# EAGLE design ARC Lighting v1.0 (EAGLE 6.4)
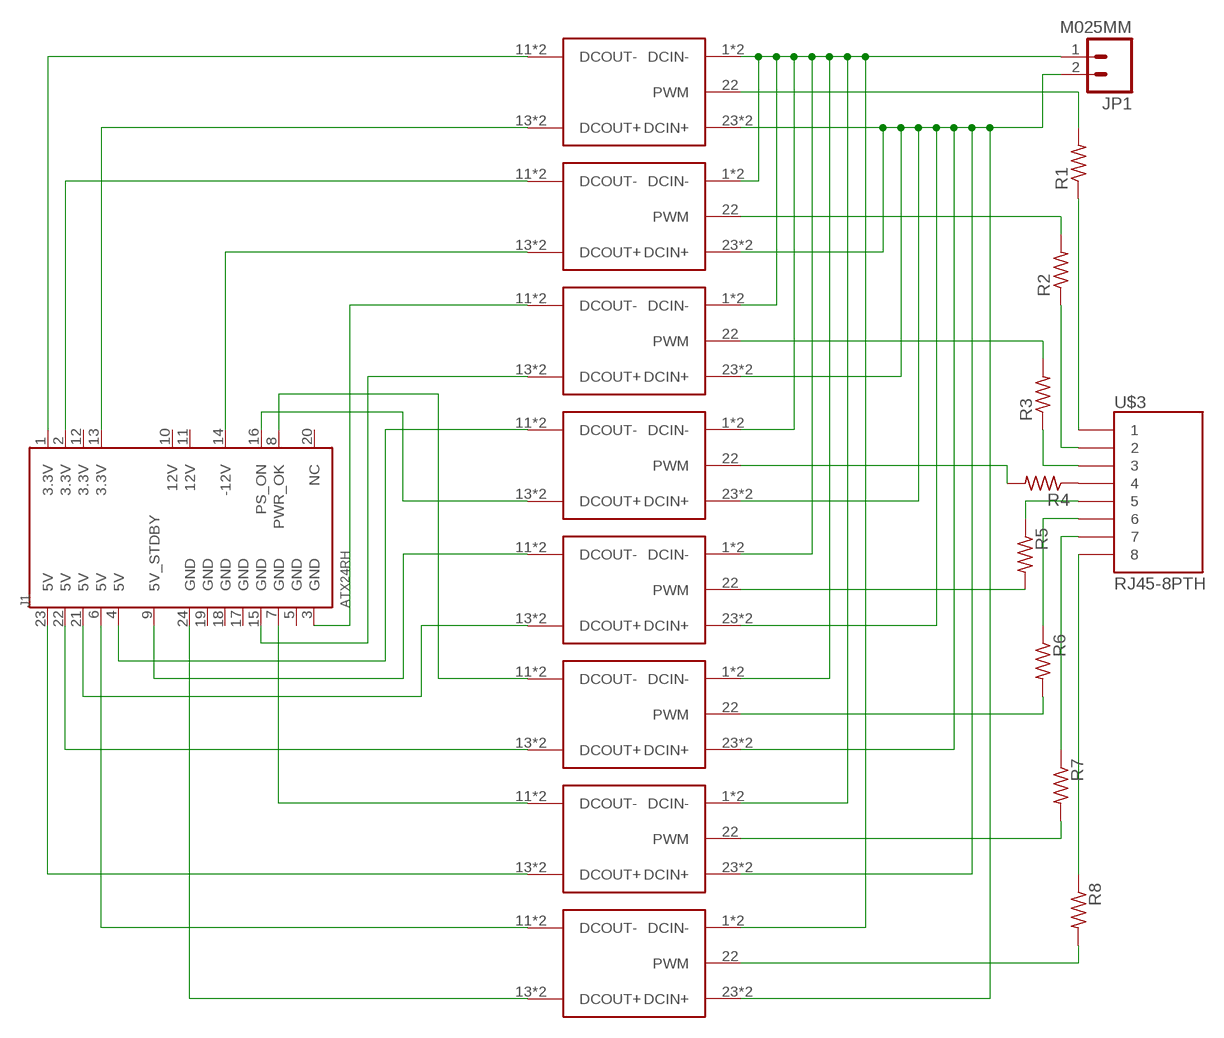
[diagram p0: schematic, sheet 1]

## Parts
J1  ATX24RH  [ATX24_RIGHT_ANGLE]
JP1  M025MM  [SCREWTERMINAL-5MM-2]
R1  R-US_0204/7  [0204/7]
R2  R-US_0204/7  [0204/7]
R3  R-US_0204/7  [0204/7]
R4  R-US_0204/7  [0204/7]
R5  R-US_0204/7  [0204/7]
R6  R-US_0204/7  [0204/7]
R7  R-US_0204/7  [0204/7]
R8  R-US_0204/7  [0204/7]
U$1  1  LDD_H  [LDD_H]
U$2  2  LDD_H  [LDD_H]
U$3  RJ45-8PTH  [RJ45-8]
U$4  3  LDD_H  [LDD_H]
U$5  4  LDD_H  [LDD_H]
U$6  5  LDD_H  [LDD_H]
U$7  6  LDD_H  [LDD_H]
U$8  7  LDD_H  [LDD_H]
U$9  8  LDD_H  [LDD_H]

## Nets
N$1 [1A]: J1.13(3.3V) U$1.13(DCOUT+) U$1.14(DCOUT+)
N$2: R2.2 U$2.22(PWM)
N$3: R3.2 U$4.22(PWM)
N$4: R4.1 U$3.4
N$5: R8.2 U$9.22(PWM)
N$6: R7.2 U$8.22(PWM)
N$7: R6.2 U$7.22(PWM)
N$8: R5.2 U$6.22(PWM)
N$9 [1A]: J1.1(3.3V) U$1.11(DCOUT-) U$1.12(DCOUT-)
N$10 [7.5A]: JP1.1 U$1.1(DCIN-) U$1.2(DCIN-) U$2.1(DCIN-) U$2.2(DCIN-) U$4.1(DCIN-) U$4.2(DCIN-) U$5.1(DCIN-) U$5.2(DCIN-) U$6.1(DCIN-) U$6.2(DCIN-) U$7.1(DCIN-) U$7.2(DCIN-) U$8.1(DCIN-) U$8.2(DCIN-) U$9.1(DCIN-) U$9.2(DCIN-)
N$11 [7.5A]: JP1.2 U$1.23(DCIN+) U$1.24(DCIN+) U$2.23(DCIN+) U$2.24(DCIN+) U$4.23(DCIN+) U$4.24(DCIN+) U$5.23(DCIN+) U$5.24(DCIN+) U$6.23(DCIN+) U$6.24(DCIN+) U$7.23(DCIN+) U$7.24(DCIN+) U$8.23(DCIN+) U$8.24(DCIN+) U$9.23(DCIN+) U$9.24(DCIN+)
N$12 [1A]: J1.2(3.3V) U$2.11(DCOUT-) U$2.12(DCOUT-)
N$13 [1A]: J1.14(-12V) U$2.13(DCOUT+) U$2.14(DCOUT+)
N$14 [1A]: J1.3(GND) U$4.11(DCOUT-) U$4.12(DCOUT-)
N$15 [1A]: J1.15(GND) U$4.13(DCOUT+) U$4.14(DCOUT+)
N$16 [1A]: J1.4(5V) U$5.11(DCOUT-) U$5.12(DCOUT-)
N$17 [1A]: J1.16(PS_ON) U$5.13(DCOUT+) U$5.14(DCOUT+)
N$18 [1A]: J1.9(5V_STDBY) U$6.11(DCOUT-) U$6.12(DCOUT-)
N$19 [1A]: J1.21(5V) U$6.13(DCOUT+) U$6.14(DCOUT+)
N$20 [1A]: J1.8(PWR_OK) U$7.11(DCOUT-) U$7.12(DCOUT-)
N$21 [1A]: J1.22(5V) U$7.13(DCOUT+) U$7.14(DCOUT+)
N$22 [1A]: J1.7(GND) U$8.11(DCOUT-) U$8.12(DCOUT-)
N$23 [1A]: J1.23(5V) U$8.13(DCOUT+) U$8.14(DCOUT+)
N$24 [1A]: J1.6(5V) U$9.11(DCOUT-) U$9.12(DCOUT-)
N$25 [1A]: J1.24(GND) U$9.13(DCOUT+) U$9.14(DCOUT+)
N$26: R2.1 U$3.2
N$27: R3.1 U$3.3
N$28: R5.1 U$3.5
N$29: R6.1 U$3.6
N$30: R7.1 U$3.7
N$31: R1.1 U$3.1
N$32: R4.2 U$5.22(PWM)
N$33: R8.1 U$3.8
N$34: R1.2 U$1.22(PWM)
Unconnected: J1.5(GND) J1.10(12V) J1.11(12V) J1.12(3.3V) J1.17(GND) J1.18(GND) J1.19(GND) J1.20(NC)

## Library data of the parts
J1 = SparkFun-Connectors:ATX24: ATX24 Pin Power Supply Connector This is a good connector for connecting a computer power supply to a PCB. It's massive, but provides many amps of power at 5V and 12V. SKU: PRT-09498
JP1 = SparkFun-Connectors:M02: Standard 2-pin 0.1" header. Use with - straight break away headers ( PRT-00116) - right angle break away headers (PRT-00553) - swiss pins (PRT-00743) - machine pins (PRT-00117) - female headers (PRT-00115) Molex polarized connector foot print use with: PRT-08233 with associated crimp pins and housings. 2.54_SCREWTERM for use with PRT-10571. 3.5mm Screw Terminal footprints for PRT-08084 5mm Screw Terminal footprints for use with PRT-08432; STOREFRONT_ID: PRT-08432
R1-R8 = resistor:R-US_: RESISTOR, American symbol
U$1 U$2 U$4-U$9 = meanwell_dcdc:LDD_H
U$3 = SparkFun-Connectors:RJ45-8: RJ45 Jack Simple RJ45, 8-pin connection - connector for common Cat5, Cat5e, and Cat6 Ethernet cables. Footprint not yet proven in production. Connector sku is PRT-00643; Breakout PCB sku is BOB-00716.

## Net classes
0 default: width 0.178 mm, drill 0.356 mm, clearance 0.508 mm
1 7.5A: width 4.826 mm, drill 0.356 mm, clearance 0.508 mm
2 1A: width 0.406 mm, drill 0.356 mm, clearance 0.508 mm
4 1.5A: width 0.889 mm, clearance 0.762 mm

## Board
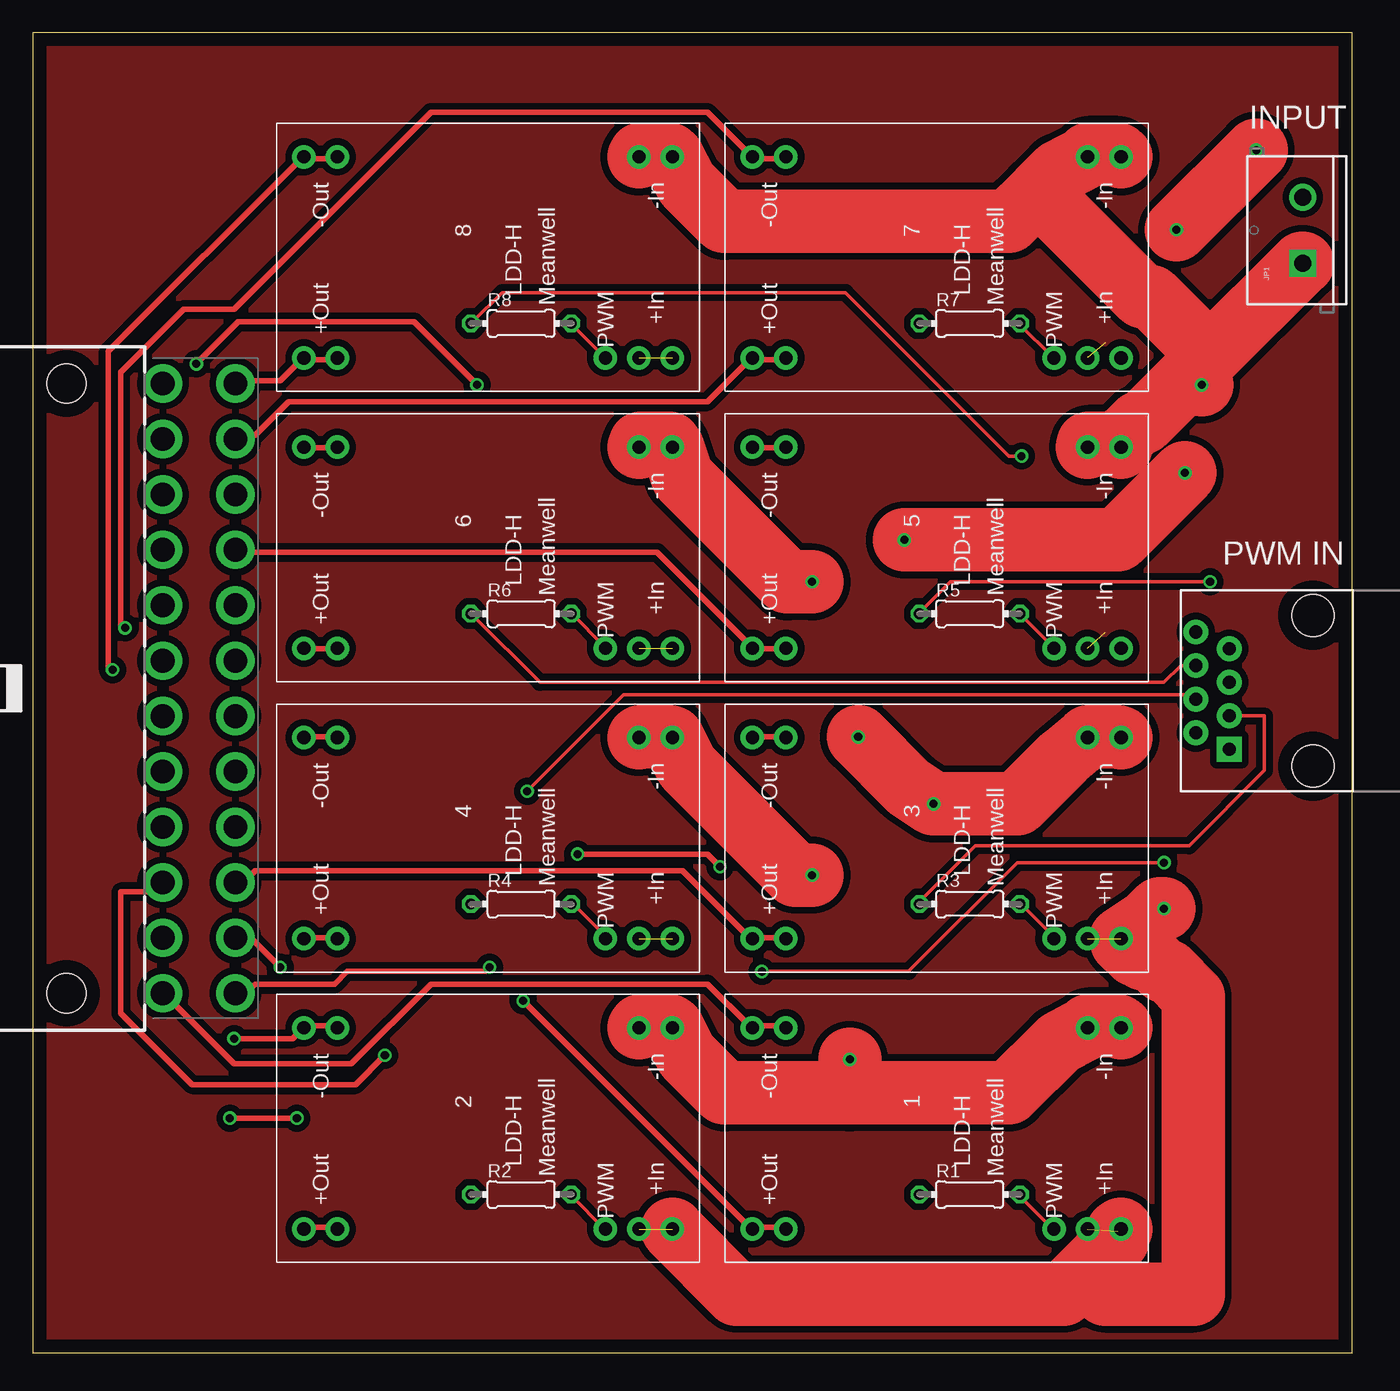
[diagram p1: board, top side]
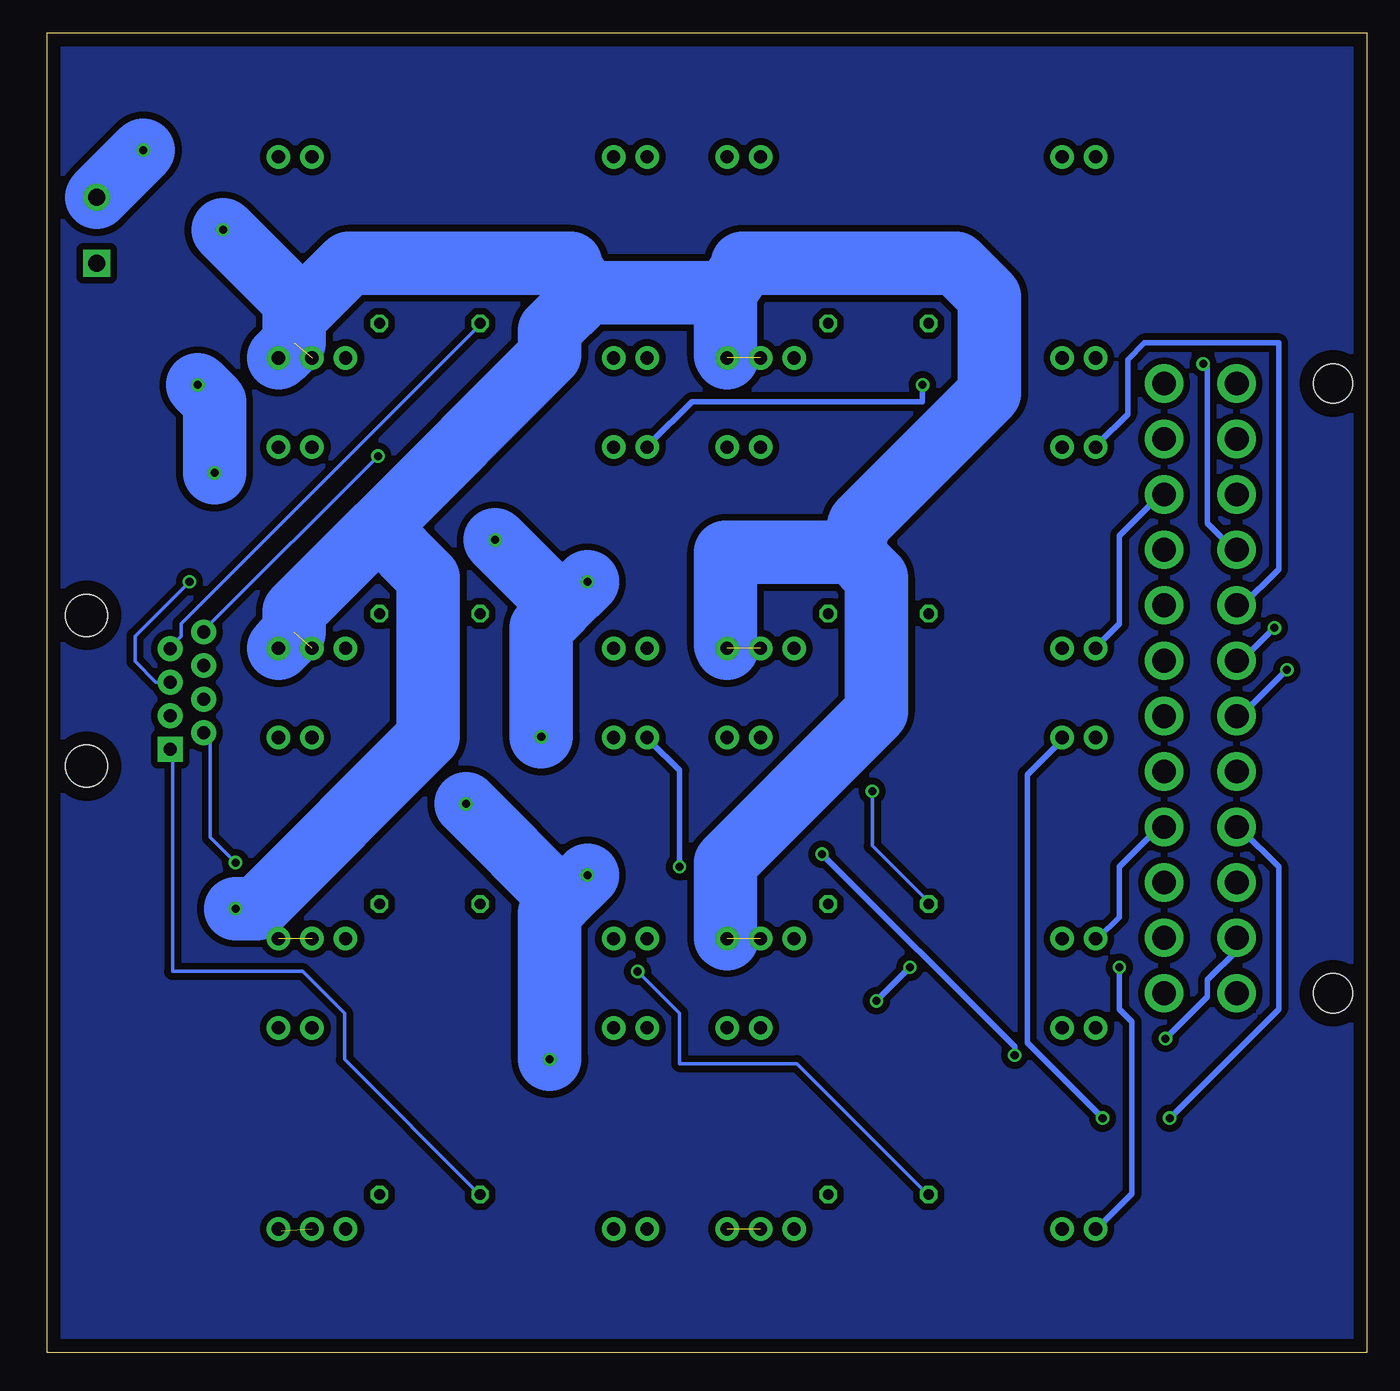
[diagram p2: board, bottom side, seen from below]

Size 100 x 100 mm. Coordinates in mm from the lower left corner, seen from the top.
Outline: 0,0 100,0 100,100 0,100 0,0
Copper layers (1*16): Top 0.035mm / dielectric 1.5mm / Bottom 0.035mm
Design rules "default": minimum track width 10mil, minimum drill 24mil, track to track 8mil, track to pad 8mil, pad to pad 8mil, via to via 8mil, smd to smd 8mil, copper to edge 40mil, drill to drill 8mil, minimum pad ring 10mil, minimum via ring 8mil, stop-mask expansion 4mil, vias tented up to drill 0mil, thermal gap 10mil

### Footprints (pad centres in the part's own frame; a part is rotated, then mirrored left to right if it is on the bottom)
ATX24_RIGHT_ANGLE = drill 1.8 pad 2.9: 1 23.1,4.76; 2 18.9,4.76; 3 14.7,4.76; 4 10.5,4.76; 5 6.3,4.76; 6 2.1,4.76; 7 -2.1,4.76; 8 -6.3,4.76; 9 -10.5,4.76; 10 -14.7,4.76; 11 -18.9,4.76; 12 -23.1,4.76; 13 23.1,10.26; 14 18.9,10.26; 15 14.7,10.26; 16 10.5,10.26; 17 6.3,10.26; 18 2.1,10.26; 19 -2.1,10.26; 20 -6.3,10.26; 21 -10.5,10.26; 22 -14.7,10.26; 23 -18.9,10.26; 24 -23.1,10.26 | hole 3: -23.1,-2.54; 23.1,-2.54
SCREWTERMINAL-5MM-2 = drill 1.3 pad 2.032 square: 1 0,0 | drill 1.3 pad 2.032: 2 5,0
0204/7 = drill 0.813 octagon: 1 -3.81,0; 2 3.81,0
LDD_H = drill 1 pad 1.778: 1 -7.62,13.97; 2 -7.62,11.43; 11 -7.62,-11.43; 12 -7.62,-13.97; 13 7.62,-13.97; 14 7.62,-11.43; 22 7.62,8.89; 23 7.62,11.43; 24 7.62,13.97
RJ45-8 = drill 1 pad 1.88 square: 1 -4.445,6.35 | drill 1 pad 1.88: 2 -3.175,8.89; 3 -1.905,6.35; 4 -0.635,8.89; 5 0.635,6.35; 6 1.905,8.89; 7 3.175,6.35; 8 4.445,8.89 | hole 3.2: -5.715,0; 5.715,0

### Placement (x,y rotation side)
J1  5.08,50.34 270 top
JP1  96.25,82.55 90 top
R1  71,12 0 top
R2  37,12 0 top
R3  71,34 0 top
R4  37,34 0 top
R5  71,56 0 top
R6  37,56 0 top
R7  71,78 0 top
R8  37,78 0 top
U$1  68.5,17 270 top
U$2  34.5,17 270 top
U$3  97.02,50.16 90 top
U$4  68.5,39 270 top
U$5  34.5,39 270 top
U$6  68.5,61 270 top
U$7  34.5,61 270 top
U$8  68.5,83 270 top
U$9  34.5,83 270 top

### Tracks (layer width: path | path; a pad name or v marks a point on that pad's centre or on a via)
12V
  pour Top: 0,100 100,100 100,0 0,0
GND
  pour Bottom: 0,100 100,100 100,0 0,0
N$1  (via drill 0.61)
  Top 0.406: U$1.14 56.83,9.53 54.61,9.53 U$1.13 54.29,9.53 v37.15,26.67 | v34.61,29.21 34.29,28.89 23.81,28.89 22.86,27.94 16.83,27.94 16.19,27.3 15.56,27.3 J1.13
  Bottom 0.406: v34.61,29.21 v37.15,26.67
N$2
  Top 0.254: R2.2 40.96,11.75 43.18,9.53 U$2.22
N$3
  Top 0.254: R3.2 74.93,33.97 77.47,31.43 U$4.22
N$4  (via drill 0.61)
  Top 0.254: v37.47,42.55 44.77,49.85 87.63,49.85 87.95,49.53 U$3.4
  Bottom 0.254: v37.47,42.55 37.47,38.42 33.34,34.29 R4.1
N$5
  Top 0.254: R8.2 40.96,77.79 43.18,75.56 U$9.22
N$6
  Top 0.254: R7.2 74.93,77.79 77.15,75.56 U$8.22
N$7
  Top 0.254: R6.2 40.96,55.88 43.18,53.66 U$7.22
N$8
  Top 0.254: R5.2 77.15,53.66 U$6.22
N$9
  Top 0.406: U$1.11 56.83,24.77 54.61,24.77 U$1.12 54.29,24.77 51.12,27.94 30.16,27.94 24.13,21.91 15.24,21.91 10.16,26.99 9.84,26.99 J1.1
N$10  (via drill 0.61)
  Top 4.826: 82.23,68.9 80.01,68.9 U$6.2 | 82.23,68.9 U$6.1 | 87.79,74.14 84.14,70.48 83.82,70.48 82.23,68.9 | 87.79,74.14 89.22,75.56 | 89.22,75.56 96.2,82.55 JP1.1 | U$9.2 46.04,90.81 48.26,90.81 U$9.1 49.53,88.58 52.39,85.72 73.98,85.72 76.2,87.95 | U$8.1 82.23,90.81 80.01,90.81 U$8.2 77.79,89.53 76.2,87.95 | 89.22,75.56 84.77,80.01 84.14,80.01 76.2,87.95 | U$7.2 46.04,68.9 48.26,68.9 U$7.1 49.21,66.36 57.15,58.42 v59.05,58.42 | U$4.1 82.23,46.67 80.01,46.67 U$4.2 78.11,45.09 74.61,41.59 v68.26,41.59 66.36,42.86 v62.55,46.67 | U$5.2 46.04,46.67 48.26,46.67 U$5.1 49.53,44.45 57.78,36.2 v59.05,36.2 | U$2.2 46.04,24.77 48.26,24.77 U$2.1 49.53,22.54 52.39,19.68 61.91,19.68 | U$1.1 82.23,24.77 80.01,24.77 U$1.2 77.79,23.5 73.98,19.68 61.91,19.68 | v61.91,22.23 61.91,19.68 | v87.31,66.67 82.23,61.59 v66.04,61.59 | v88.58,73.34 87.79,74.14
  Bottom 4.826: 60.96,34.29 61.91,33.34 v61.91,22.23 | 60.96,34.29 v59.05,36.2 | 60.96,34.29 v68.26,41.59 | 60.96,56.52 62.55,54.93 v62.55,46.67 | 60.96,56.52 v59.05,58.42 | v88.58,73.34 87.31,72.07 v87.31,66.67 | 60.96,56.52 v66.04,61.59
N$11  (via drill 0.61)  (8 unrouted)
  Top 4.826: 79.69,6.03 82.23,8.57 82.23,9.21 U$1.24 | 79.69,6.03 78.11,4.45 53.34,4.45 48.58,9.21 U$2.24 | 79.69,6.03 81.28,4.45 87.95,4.45 87.95,26.99 86.04,28.89 85.72,28.89 84.77,29.84 84.14,29.84 83.82,30.16 83.5,30.16 82.55,31.11 U$4.24 84.45,32.7 85.41,33.66 v85.72,33.66 | v86.68,85.09 v92.71,91.12
  Bottom 4.826: 39.05,60.64 37.15,58.74 37.15,48.58 48.58,37.15 48.58,31.43 U$5.24 | 39.05,60.64 48.58,60.64 48.58,53.66 U$7.24 | 74.93,62.55 61.91,75.56 61.91,77.47 59.05,80.33 | 74.93,62.55 81.28,56.2 81.28,54.61 82.23,53.66 U$6.24 | 48.58,80.33 59.05,80.33 | 48.58,80.33 48.58,75.56 U$9.24 | 80.64,79.06 77.15,82.55 60.33,82.55 60.33,82.23 59.05,80.33 | 80.64,79.06 81.28,78.42 81.28,76.52 82.23,75.56 U$8.24 | v92.71,91.12 96.2,87.63 JP1.2 | 80.64,79.06 v86.68,85.09 | 39.05,60.64 38.42,62.87 28.57,72.71 28.57,80.01 31.11,82.55 47.31,82.55 47.31,82.23 48.58,80.33 | v85.72,33.66 84.14,33.66 71.12,46.67 71.12,58.74 74.93,62.55
N$12  (via drill 0.61)
  Top 0.406: U$2.11 22.86,24.77 20.64,24.77 U$2.12 20.32,24.45 19.68,23.81 v15.24,23.81
  Bottom 0.406: v15.24,23.81 12.06,26.99 12.06,28.26 9.84,30.48 J1.2
N$13  (via drill 0.61)
  Top 0.406: U$2.13 20.64,9.53 22.86,9.53 U$2.14 | v18.73,29.21 16.51,31.43 15.56,31.43 J1.14
  Bottom 0.406: v18.73,29.21 18.73,26.04 17.78,25.08 17.78,12.06 20.32,9.53 U$2.13
N$14  (via drill 0.61)
  Top 0.406: U$4.12 54.61,46.67 56.83,46.67 U$4.11 | v52.07,36.83 51.12,37.78 v41.27,37.78 | v26.67,22.54 24.45,20.32 12.06,20.32 6.67,25.72 6.67,34.92 8.89,34.92 9.53,35.56 J1.3
  Bottom 0.406: v52.07,36.83 52.07,44.13 54.29,46.35 U$4.12 | v41.27,37.78 26.67,23.18 v26.67,22.54
N$15
  Top 0.406: U$4.14 56.83,31.43 54.61,31.43 U$4.13 54.29,31.43 49.21,36.51 16.83,36.51 15.88,35.56 15.56,35.56 J1.15
N$16  (via drill 0.61)
  Top 0.406: U$5.12 20.64,46.67 22.86,46.67 U$5.11 | v14.92,17.78 v20,17.78
  Bottom 0.406: v20,17.78 25.72,23.5 25.72,43.81 23.18,46.35 U$5.11 | v14.92,17.78 6.67,26.04 6.67,36.83 9.53,39.69 J1.4
N$17
  Top 0.406: U$5.13 20.64,31.43 22.86,31.43 U$5.14
  Bottom 0.406: U$5.13 20.32,31.43 18.73,33.02 18.73,36.83 15.56,40.01 J1.16
N$18  (via drill 0.61)
  Top 0.406: U$6.12 54.61,68.58 56.83,68.58 U$6.11 | v33.66,73.34 28.89,78.11 15.56,78.11 v12.38,74.93
  Bottom 0.406: v33.66,73.34 33.66,72.07 51.12,72.07 54.29,68.9 U$6.12 | v12.38,74.93 12.06,74.61 12.06,62.87 9.84,60.64 J1.9
N$19
  Top 0.406: U$6.14 56.83,53.34 54.61,53.34 U$6.13 54.29,53.66 47.31,60.64 15.56,60.64 J1.21
N$20
  Top 0.406: U$7.12 20.64,68.58 22.86,68.58 U$7.11
  Bottom 0.406: U$7.12 20.32,68.9 18.1,71.12 18.1,75.25 16.83,76.52 6.67,76.52 6.67,59.37 9.53,56.52 J1.8
N$21
  Top 0.406: U$7.13 20.64,53.34 22.86,53.34 U$7.14
  Bottom 0.406: U$7.13 20.32,53.66 18.73,55.24 18.73,61.91 15.56,65.09 J1.22
N$22  (via drill 0.61)
  Top 0.406: U$8.11 56.83,90.49 54.61,90.49 U$8.12 54.29,90.81 51.12,93.98 30.16,93.98 15.24,79.06 11.43,79.06 6.67,74.3 6.67,54.93 v6.99,54.93
  Bottom 0.406: v6.99,54.93 9.53,52.39 J1.7
N$23
  Top 0.406: U$8.14 56.83,75.25 54.61,75.25 U$8.13 54.29,75.25 51.12,72.07 19.37,72.07 16.83,69.53 15.56,69.53 J1.23
N$24  (via drill 0.61)
  Top 0.406: U$9.11 22.86,90.49 20.64,90.49 U$9.12 20.32,90.49 5.71,75.88 5.71,51.75 v6.03,51.75
  Bottom 0.406: v6.03,51.75 9.53,48.26 J1.6
N$25
  Top 0.406: U$9.14 22.86,75.25 20.64,75.25 U$9.13 20.32,75.25 18.73,73.66 15.56,73.66 J1.24
N$26  (via drill 0.61)
  Top 0.254: v55.24,28.89 66.36,28.89 74.61,37.15 v85.72,37.15
  Bottom 0.254: v55.24,28.89 52.07,25.72 52.07,21.91 43.18,21.91 33.34,12.06 R2.1 | v85.72,37.15 87.63,39.05 87.63,46.67 87.95,46.99 U$3.2
N$27
  Top 0.254: U$3.3 93.34,48.26 93.34,44.13 87.63,38.42 71.44,38.42 67.31,34.29 R3.1
N$28  (via drill 0.61)
  Top 0.254: v89.22,58.42 69.53,58.42 67.31,56.2 R5.1
  Bottom 0.254: v89.22,58.42 93.34,54.29 93.34,52.39 91.76,50.8 U$3.5
N$29
  Top 0.254: U$3.6 87,52.07 85.72,50.8 38.42,50.8 33.34,55.88 R6.1
N$30
  Bottom 0.254: R7.1 67.31,77.79 89.85,55.24 89.85,54.29 90.49,53.66 90.49,53.34 U$3.7
N$31
  Bottom 0.254: R1.1 67.31,12.06 77.47,22.23 77.47,25.72 80.64,28.89 90.49,28.89 90.49,45.72 U$3.1
N$32
  Top 0.254: R4.2 40.96,33.97 43.5,31.43 U$5.22
N$33  (via drill 0.61)
  Top 0.254: v74.93,67.94 73.98,67.94 61.59,80.33 35.56,80.33 33.34,78.11 R8.1
  Bottom 0.254: v74.93,67.94 87.95,54.93 87.95,54.61 U$3.8
N$34
  Top 0.254: R1.2 74.93,11.75 77.15,9.53 U$1.22

### Text on the board
tPlace: INPUT | PWM IN | ARC Lighting v1.0